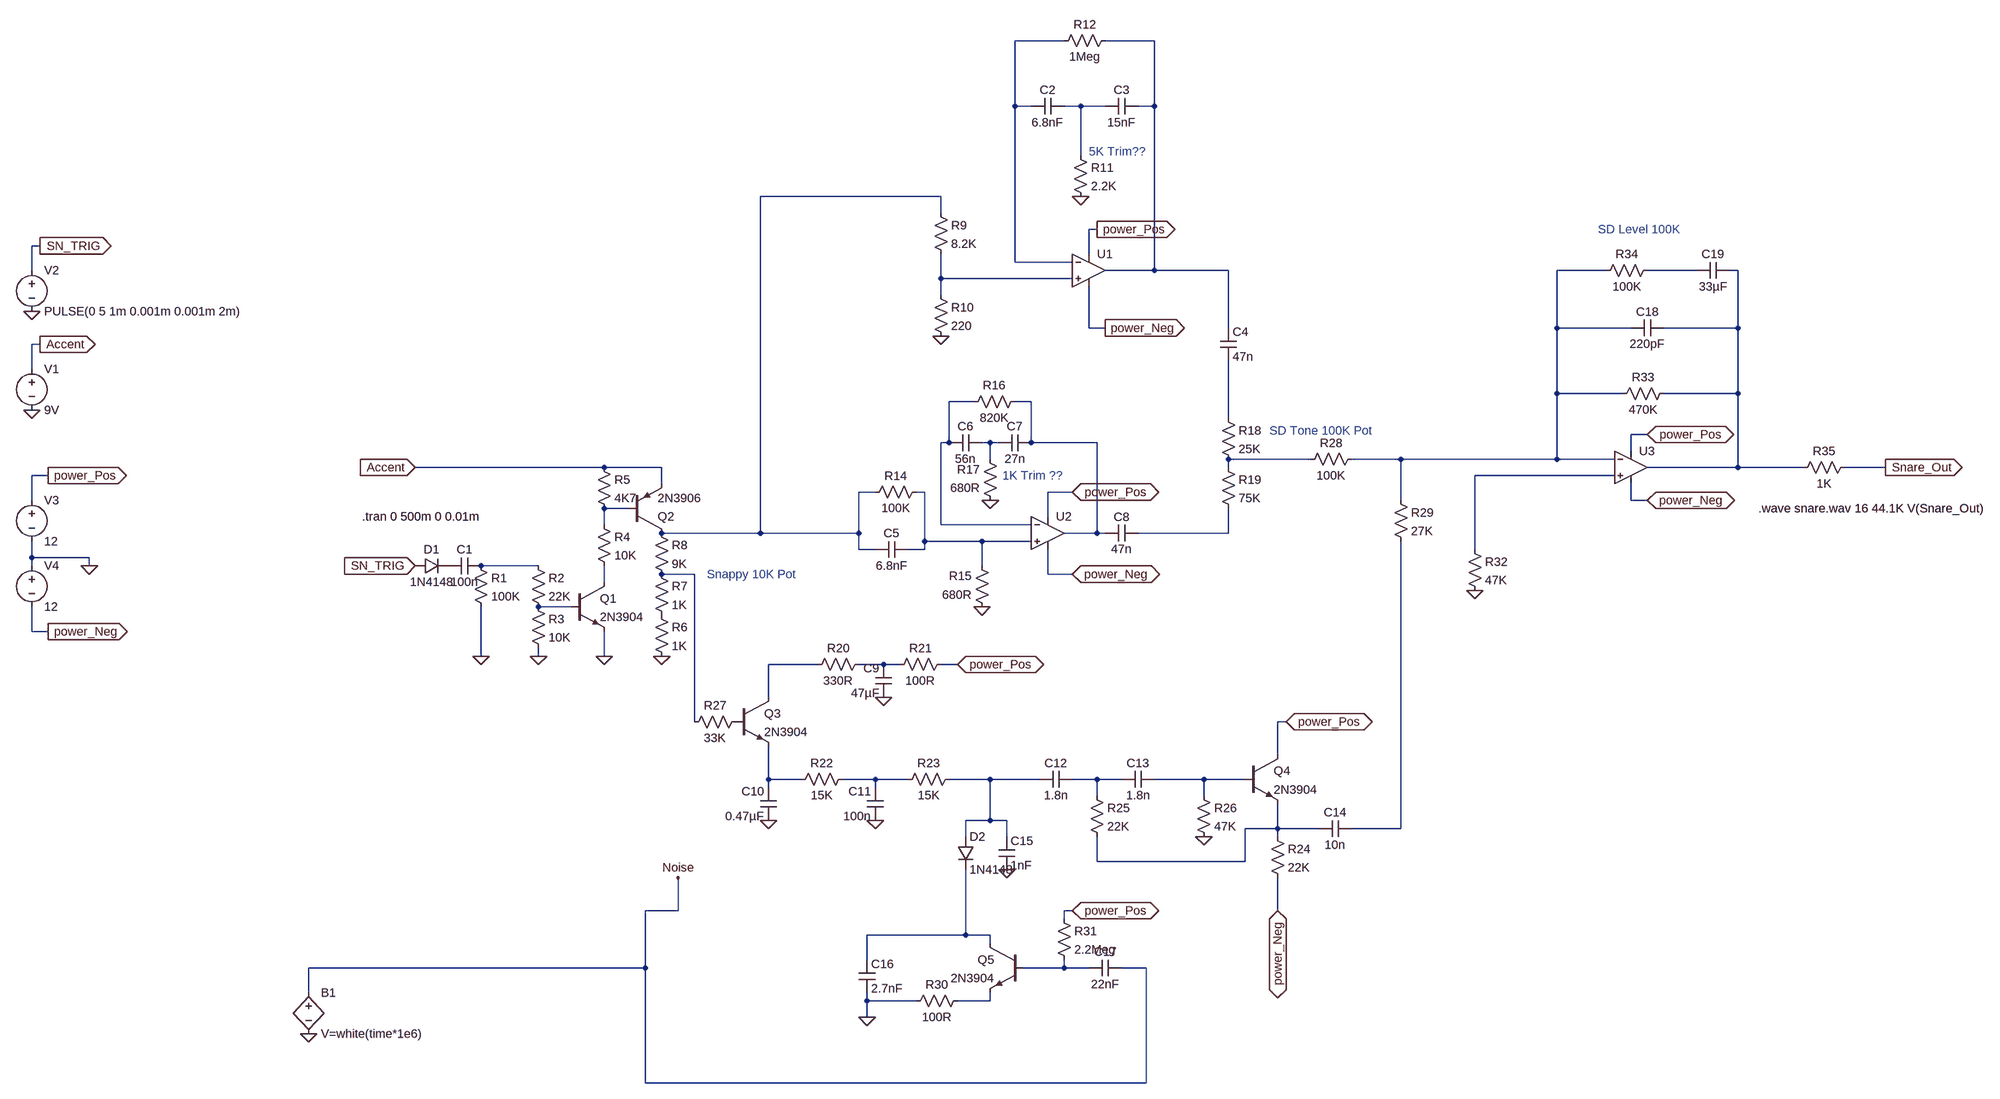
[diagram p0: schematic Snare.asc]
Snare.asc, the LTspice schematic file:
Version 4
SHEET 1 3088 1092
WIRE 1264 -944 1168 -944
WIRE 1440 -944 1344 -944
WIRE 1168 -816 1168 -944
WIRE 1200 -816 1168 -816
WIRE 1296 -816 1264 -816
WIRE 1344 -816 1296 -816
WIRE 1440 -816 1440 -944
WIRE 1440 -816 1408 -816
WIRE 1296 -720 1296 -816
WIRE 1024 -640 672 -640
WIRE 1024 -608 1024 -640
WIRE 1328 -576 1312 -576
WIRE -816 -544 -832 -544
WIRE 1312 -528 1312 -576
WIRE 1168 -512 1168 -816
WIRE 1280 -512 1168 -512
WIRE -832 -496 -832 -544
WIRE 1440 -496 1440 -816
WIRE 1440 -496 1344 -496
WIRE 1584 -496 1440 -496
WIRE 2320 -496 2224 -496
WIRE 2496 -496 2400 -496
WIRE 2576 -496 2560 -496
WIRE 1024 -480 1024 -528
WIRE 1280 -480 1024 -480
WIRE 1024 -448 1024 -480
WIRE 1312 -384 1312 -464
WIRE 1344 -384 1312 -384
WIRE 1584 -384 1584 -496
WIRE 2224 -384 2224 -496
WIRE 2368 -384 2224 -384
WIRE 2576 -384 2576 -496
WIRE 2576 -384 2432 -384
WIRE -816 -352 -832 -352
WIRE -832 -304 -832 -352
WIRE 2224 -256 2224 -384
WIRE 2352 -256 2224 -256
WIRE 2576 -256 2576 -384
WIRE 2576 -256 2432 -256
WIRE 1088 -240 1040 -240
WIRE 1200 -240 1168 -240
WIRE 1584 -208 1584 -320
WIRE 2400 -176 2368 -176
WIRE 1040 -160 1040 -240
WIRE 1040 -160 1024 -160
WIRE 1120 -160 1104 -160
WIRE 1136 -160 1120 -160
WIRE 1200 -160 1200 -240
WIRE 1328 -160 1200 -160
WIRE 2368 -144 2368 -176
WIRE 1120 -128 1120 -160
WIRE 1744 -128 1584 -128
WIRE 1920 -128 1824 -128
WIRE 2224 -128 2224 -256
WIRE 2224 -128 1920 -128
WIRE 2336 -128 2224 -128
WIRE 368 -112 0 -112
WIRE 480 -112 368 -112
WIRE 1584 -112 1584 -128
WIRE 2576 -112 2576 -256
WIRE 2576 -112 2400 -112
WIRE 2704 -112 2576 -112
WIRE 2864 -112 2784 -112
WIRE -800 -96 -832 -96
WIRE 2336 -96 2064 -96
WIRE 480 -80 480 -112
WIRE 896 -64 864 -64
WIRE 992 -64 976 -64
WIRE 1280 -64 1232 -64
WIRE -832 -48 -832 -96
WIRE 1920 -48 1920 -128
WIRE 2368 -48 2368 -80
WIRE 2400 -48 2368 -48
WIRE 416 -32 368 -32
WIRE 1232 -16 1232 -64
WIRE 368 0 368 -32
WIRE 1024 0 1024 -160
WIRE 1200 0 1024 0
WIRE 672 16 672 -640
WIRE 672 16 480 16
WIRE 864 16 864 -64
WIRE 864 16 672 16
WIRE 1328 16 1328 -160
WIRE 1328 16 1264 16
WIRE 1344 16 1328 16
WIRE 1584 16 1584 -32
WIRE 1584 16 1408 16
WIRE 992 32 992 -64
WIRE 1104 32 992 32
WIRE 1200 32 1104 32
WIRE 864 48 864 16
WIRE 896 48 864 48
WIRE 992 48 992 32
WIRE 992 48 960 48
WIRE 2064 48 2064 -96
WIRE -832 64 -832 32
WIRE -720 64 -832 64
WIRE -832 80 -832 64
WIRE -720 80 -720 64
WIRE 240 80 128 80
WIRE 1104 80 1104 32
WIRE 544 96 480 96
WIRE 1232 96 1232 48
WIRE 1280 96 1232 96
WIRE 368 112 368 80
WIRE 304 160 240 160
WIRE -832 208 -832 160
WIRE -800 208 -832 208
WIRE 128 256 128 160
WIRE 240 256 240 240
WIRE 368 256 368 208
WIRE 784 272 688 272
WIRE 912 272 864 272
WIRE 944 272 912 272
WIRE 1056 272 1024 272
WIRE 688 336 688 272
WIRE 544 384 544 96
WIRE 1696 384 1680 384
WIRE 1680 448 1680 384
WIRE 688 496 688 432
WIRE 752 496 688 496
WIRE 896 496 832 496
WIRE 960 496 896 496
WIRE 1120 496 1040 496
WIRE 1216 496 1120 496
WIRE 1328 496 1280 496
WIRE 1376 496 1328 496
WIRE 1536 496 1440 496
WIRE 1616 496 1536 496
WIRE 688 512 688 496
WIRE 896 512 896 496
WIRE 1328 528 1328 496
WIRE 1536 528 1536 496
WIRE 1120 576 1120 496
WIRE 1120 576 1072 576
WIRE 1152 576 1120 576
WIRE 1680 592 1680 544
WIRE 1680 592 1616 592
WIRE 1760 592 1680 592
WIRE 1920 592 1920 32
WIRE 1920 592 1824 592
WIRE 1072 608 1072 576
WIRE 1152 608 1152 576
WIRE 1680 608 1680 592
WIRE 1328 656 1328 608
WIRE 1616 656 1616 592
WIRE 1616 656 1328 656
WIRE 512 752 512 688
WIRE 512 752 448 752
WIRE 1280 752 1264 752
WIRE 1680 752 1680 688
WIRE 1264 768 1264 752
WIRE 1072 800 1072 672
WIRE 1072 800 880 800
WIRE 1120 800 1072 800
WIRE 1120 816 1120 800
WIRE 880 848 880 800
WIRE 448 864 448 752
WIRE 448 864 -208 864
WIRE 1264 864 1264 848
WIRE 1264 864 1184 864
WIRE 1312 864 1264 864
WIRE 1424 864 1376 864
WIRE -208 912 -208 864
WIRE 880 928 880 912
WIRE 976 928 880 928
WIRE 1120 928 1120 912
WIRE 1120 928 1056 928
WIRE 880 960 880 928
WIRE 448 1088 448 864
WIRE 1424 1088 1424 864
WIRE 1424 1088 448 1088
FLAG -816 -352 Accent
IOPIN -816 -352 Out
FLAG 0 80 SN_TRIG
IOPIN 0 80 In
FLAG 128 256 0
FLAG 240 256 0
FLAG 368 256 0
FLAG 480 256 0
FLAG -832 -224 0
FLAG -832 -416 0
FLAG 0 -112 Accent
IOPIN 0 -112 In
FLAG -816 -544 SN_TRIG
IOPIN -816 -544 Out
FLAG 1328 -576 power_Pos
IOPIN 1328 -576 Out
FLAG -800 208 power_Neg
IOPIN -800 208 Out
FLAG -720 80 0
FLAG 1296 -640 0
FLAG 1024 -368 0
FLAG -800 -96 power_Pos
IOPIN -800 -96 Out
FLAG 1344 -384 power_Neg
IOPIN 1344 -384 Out
FLAG 1120 -48 0
FLAG 1104 160 0
FLAG 1280 -64 power_Pos
IOPIN 1280 -64 BiDir
FLAG 1280 96 power_Neg
IOPIN 1280 96 BiDir
FLAG 1056 272 power_Pos
IOPIN 1056 272 BiDir
FLAG 1696 384 power_Pos
IOPIN 1696 384 BiDir
FLAG 1680 752 power_Neg
IOPIN 1680 752 BiDir
FLAG 1536 608 0
FLAG 688 576 0
FLAG 896 576 0
FLAG 912 336 0
FLAG 1152 672 0
FLAG 880 960 0
FLAG 1280 752 power_Pos
IOPIN 1280 752 BiDir
FLAG 512 688 Noise
FLAG -208 992 0
FLAG 2864 -112 Snare_Out
IOPIN 2864 -112 Out
FLAG 2064 128 0
FLAG 2400 -176 power_Pos
IOPIN 2400 -176 BiDir
FLAG 2400 -48 power_Neg
IOPIN 2400 -48 BiDir
SYMBOL diode 0 96 R270
WINDOW 0 32 32 VTop 2
WINDOW 3 0 32 VBottom 2
SYMATTR InstName D1
SYMATTR Value 1N4148
SYMBOL cap 128 64 R90
WINDOW 0 0 32 VBottom 2
WINDOW 3 32 32 VTop 2
SYMATTR InstName C1
SYMATTR Value 100n
SYMBOL res 112 64 R0
SYMATTR InstName R1
SYMATTR Value 100K
SYMBOL res 224 64 R0
SYMATTR InstName R2
SYMATTR Value 22K
SYMBOL res 224 144 R0
SYMATTR InstName R3
SYMATTR Value 10K
SYMBOL res 352 -16 R0
SYMATTR InstName R4
SYMATTR Value 10K
SYMBOL pnp 416 16 M180
SYMATTR InstName Q2
SYMATTR Value 2N3906
SYMBOL npn 304 112 R0
SYMATTR InstName Q1
SYMATTR Value 2N3904
SYMBOL res 352 -128 R0
SYMATTR InstName R5
SYMATTR Value 4K7
SYMBOL res 464 160 R0
SYMATTR InstName R6
SYMATTR Value 1K
SYMBOL res 464 80 R0
SYMATTR InstName R7
SYMATTR Value 1K
SYMBOL res 464 0 R0
SYMATTR InstName R8
SYMATTR Value 9K
SYMBOL voltage -832 -320 R0
WINDOW 123 0 0 Left 0
WINDOW 39 0 0 Left 0
SYMATTR InstName V1
SYMATTR Value 9V
SYMBOL voltage -832 -512 R0
WINDOW 123 0 0 Left 0
WINDOW 39 0 0 Left 0
SYMATTR InstName V2
SYMATTR Value PULSE(0 5 1m 0.001m 0.001m 2m)
SYMBOL voltage -832 -64 R0
WINDOW 123 0 0 Left 0
WINDOW 39 0 0 Left 0
SYMATTR InstName V3
SYMATTR Value 12
SYMBOL voltage -832 64 R0
WINDOW 123 0 0 Left 0
WINDOW 39 0 0 Left 0
SYMATTR InstName V4
SYMATTR Value 12
SYMBOL res 1008 -624 R0
SYMATTR InstName R9
SYMATTR Value 8.2K
SYMBOL res 1008 -464 R0
SYMATTR InstName R10
SYMATTR Value 220
SYMBOL res 1280 -736 R0
SYMATTR InstName R11
SYMATTR Value 2.2K
SYMBOL res 1360 -960 R90
WINDOW 0 0 56 VBottom 2
WINDOW 3 32 56 VTop 2
SYMATTR InstName R12
SYMATTR Value 1Meg
SYMBOL cap 1264 -832 R90
WINDOW 0 0 32 VBottom 2
WINDOW 3 32 32 VTop 2
SYMATTR InstName C2
SYMATTR Value 6.8nF
SYMBOL cap 1408 -832 R90
WINDOW 0 0 32 VBottom 2
WINDOW 3 32 32 VTop 2
SYMATTR InstName C3
SYMATTR Value 15nF
SYMBOL OpAmps\\UniversalOpamp2 1312 -496 R0
SYMATTR InstName U1
SYMBOL cap 1568 -384 R0
SYMATTR InstName C4
SYMATTR Value 47n
SYMBOL cap 960 32 R90
WINDOW 0 0 32 VBottom 2
WINDOW 3 32 32 VTop 2
SYMATTR InstName C5
SYMATTR Value 6.8nF
SYMBOL res 992 -80 R90
WINDOW 0 0 56 VBottom 2
WINDOW 3 32 56 VTop 2
SYMATTR InstName R14
SYMATTR Value 100K
SYMBOL res 1120 176 R180
WINDOW 0 36 76 Left 2
WINDOW 3 36 40 Left 2
SYMATTR InstName R15
SYMATTR Value 680R
SYMBOL cap 1104 -176 R90
WINDOW 0 0 32 VBottom 2
WINDOW 3 32 32 VTop 2
SYMATTR InstName C6
SYMATTR Value 56n
SYMBOL cap 1200 -176 R90
WINDOW 0 0 32 VBottom 2
WINDOW 3 32 32 VTop 2
SYMATTR InstName C7
SYMATTR Value 27n
SYMBOL res 1184 -256 R90
WINDOW 0 0 56 VBottom 2
WINDOW 3 32 56 VTop 2
SYMATTR InstName R16
SYMATTR Value 820K
SYMBOL res 1136 -32 R180
WINDOW 0 36 76 Left 2
WINDOW 3 36 40 Left 2
SYMATTR InstName R17
SYMATTR Value 680R
SYMBOL OpAmps\\UniversalOpamp2 1232 16 R0
SYMATTR InstName U2
SYMBOL cap 1408 0 R90
WINDOW 0 0 32 VBottom 2
WINDOW 3 32 32 VTop 2
SYMATTR InstName C8
SYMATTR Value 47n
SYMBOL res 1568 -224 R0
SYMATTR InstName R18
SYMATTR Value 25K
SYMBOL res 1568 -128 R0
SYMATTR InstName R19
SYMATTR Value 75K
SYMBOL npn 624 336 R0
SYMATTR InstName Q3
SYMATTR Value 2N3904
SYMBOL res 880 256 R90
WINDOW 0 0 56 VBottom 2
WINDOW 3 32 56 VTop 2
SYMATTR InstName R20
SYMATTR Value 330R
SYMBOL res 1040 256 R90
WINDOW 0 0 56 VBottom 2
WINDOW 3 32 56 VTop 2
SYMATTR InstName R21
SYMATTR Value 100R
SYMBOL cap 928 336 R180
WINDOW 0 24 56 Left 2
WINDOW 3 24 8 Left 2
SYMATTR InstName C9
SYMATTR Value 47µF
SYMBOL cap 704 576 R180
WINDOW 0 24 56 Left 2
WINDOW 3 24 8 Left 2
SYMATTR InstName C10
SYMATTR Value 0.47µF
SYMBOL cap 912 576 R180
WINDOW 0 24 56 Left 2
WINDOW 3 24 8 Left 2
SYMATTR InstName C11
SYMATTR Value 100n
SYMBOL res 848 480 R90
WINDOW 0 0 56 VBottom 2
WINDOW 3 32 56 VTop 2
SYMATTR InstName R22
SYMATTR Value 15K
SYMBOL res 1056 480 R90
WINDOW 0 0 56 VBottom 2
WINDOW 3 32 56 VTop 2
SYMATTR InstName R23
SYMATTR Value 15K
SYMBOL cap 1280 480 R90
WINDOW 0 0 32 VBottom 2
WINDOW 3 32 32 VTop 2
SYMATTR InstName C12
SYMATTR Value 1.8n
SYMBOL cap 1440 480 R90
WINDOW 0 0 32 VBottom 2
WINDOW 3 32 32 VTop 2
SYMATTR InstName C13
SYMATTR Value 1.8n
SYMBOL npn 1616 448 R0
SYMATTR InstName Q4
SYMATTR Value 2N3904
SYMBOL res 1664 592 R0
SYMATTR InstName R24
SYMATTR Value 22K
SYMBOL res 1312 512 R0
SYMATTR InstName R25
SYMATTR Value 22K
SYMBOL res 1520 512 R0
SYMATTR InstName R26
SYMATTR Value 47K
SYMBOL res 640 368 R90
WINDOW 0 0 56 VBottom 2
WINDOW 3 32 56 VTop 2
SYMATTR InstName R27
SYMATTR Value 33K
SYMBOL res 1840 -144 R90
WINDOW 0 0 56 VBottom 2
WINDOW 3 32 56 VTop 2
SYMATTR InstName R28
SYMATTR Value 100K
SYMBOL res 1904 -64 R0
SYMATTR InstName R29
SYMATTR Value 27K
SYMBOL cap 1824 576 R90
WINDOW 0 0 32 VBottom 2
WINDOW 3 32 32 VTop 2
SYMATTR InstName C14
SYMATTR Value 10n
SYMBOL diode 1056 608 R0
SYMATTR InstName D2
SYMATTR Value 1N4148
SYMBOL cap 1136 608 R0
SYMATTR InstName C15
SYMATTR Value 1nF
SYMBOL cap 864 848 R0
SYMATTR InstName C16
SYMATTR Value 2.7nF
SYMBOL res 1072 912 R90
WINDOW 0 0 56 VBottom 2
WINDOW 3 32 56 VTop 2
SYMATTR InstName R30
SYMATTR Value 100R
SYMBOL npn2 1184 816 M0
SYMATTR InstName Q5
SYMATTR Value 2N3904
SYMBOL res 1248 752 R0
SYMATTR InstName R31
SYMATTR Value 2.2Meg
SYMBOL cap 1376 848 R90
WINDOW 0 0 32 VBottom 2
WINDOW 3 32 32 VTop 2
SYMATTR InstName C17
SYMATTR Value 22nF
SYMBOL bv -208 896 R0
SYMATTR InstName B1
SYMATTR Value V=white(time*1e6)
SYMBOL res 2048 32 R0
SYMATTR InstName R32
SYMATTR Value 47K
SYMBOL res 2448 -272 R90
WINDOW 0 0 56 VBottom 2
WINDOW 3 32 56 VTop 2
SYMATTR InstName R33
SYMATTR Value 470K
SYMBOL cap 2432 -400 R90
WINDOW 0 0 32 VBottom 2
WINDOW 3 32 32 VTop 2
SYMATTR InstName C18
SYMATTR Value 220pF
SYMBOL cap 2560 -512 R90
WINDOW 0 0 32 VBottom 2
WINDOW 3 32 32 VTop 2
SYMATTR InstName C19
SYMATTR Value 33µF
SYMBOL res 2416 -512 R90
WINDOW 0 0 56 VBottom 2
WINDOW 3 32 56 VTop 2
SYMATTR InstName R34
SYMATTR Value 100K
SYMBOL res 2800 -128 R90
WINDOW 0 0 56 VBottom 2
WINDOW 3 32 56 VTop 2
SYMATTR InstName R35
SYMATTR Value 1K
SYMBOL OpAmps\\UniversalOpamp2 2368 -112 R0
SYMATTR InstName U3
TEXT -104 -16 Left 2 !.tran 0 500m 0 0.01m
TEXT 2304 -576 Left 2 ;SD Level 100K
TEXT 568 96 Left 2 ;Snappy 10K Pot
TEXT 1664 -184 Left 2 ;SD Tone 100K Pot
TEXT 2616 -32 Left 2 !.wave snare.wav 16 44.1K V(Snare_Out)
TEXT 1312 -728 Left 2 ;5K Trim??
TEXT 1144 -96 Left 2 ;1K Trim ??

The netlist it stands for:
* Snare.asc
D1 SN_TRIG P001 1N4148
C1 N018 P001 100n
R1 N018 0 100K
R2 N018 N021 22K
R3 N021 0 10K
R4 N016 N020 10K
Q2 N004 N016 Accent 0 2N3906
Q1 N020 N021 0 0 2N3904
R5 Accent N016 4K7
R6 P002 0 1K
R7 N019 P002 1K
R8 N004 N019 9K
V1 Accent 0 9V
V2 SN_TRIG 0 PULSE(0 5 1m 0.001m 0.001m 2m)
V3 power_Pos 0 12
V4 0 power_Neg 12
R9 N004 N008 8.2K
R10 N008 0 220
R11 N003 0 2.2K
R12 N002 N001 1Meg
C2 N003 N001 6.8nF
C3 N002 N003 15nF
XU1 N008 N001 power_Pos power_Neg N002 level.2 Avol=1Meg GBW=10Meg Slew=10Meg ilimit=25m rail=0 Vos=0 phimargin=45 en=0 enk=0 in=0 ink=0 Rin=500Meg  ; pins IN+ IN- V+ V- OUT
C4 N002 N011 47n
C5 N015 N004 6.8nF
R14 N015 N004 100K
R15 0 N015 680R
C6 N012 N009 56n
C7 N010 N012 27n
R16 N010 N009 820K
R17 0 N012 680R
XU2 N015 N009 power_Pos power_Neg N010 level.2 Avol=1Meg GBW=10Meg Slew=10Meg ilimit=25m rail=0 Vos=0 phimargin=45 en=0 enk=0 in=0 ink=0 Rin=500Meg  ; pins IN+ IN- V+ V- OUT
C8 N017 N010 47n
R18 N011 N013 25K
R19 N013 N017 75K
Q3 N022 P003 N024 0 2N3904
R20 N023 N022 330R
R21 power_Pos N023 100R
C9 0 N023 47µF
C10 0 N024 0.47µF
C11 0 N025 100n
R22 N025 N024 15K
R23 N026 N025 15K
C12 N027 N026 1.8n
C13 N028 N027 1.8n
Q4 power_Pos N028 N029 0 2N3904
R24 N029 power_Neg 22K
R25 N027 N029 22K
R26 N028 0 47K
R27 P003 N019 33K
R28 N005 N013 100K
R29 N005 N030 27K
C14 N030 N029 10n
D2 N026 N031 1N4148
C15 N026 0 1nF
C16 N031 0 2.7nF
R30 N033 0 100R
Q5 N031 N032 N033 0 2N3904
R31 power_Pos N032 2.2Meg
C17 Noise N032 22nF
B1 Noise 0 V=white(time*1e6)
R32 N014 0 47K
R33 N007 N005 470K
C18 N007 N005 220pF
C19 N007 N006 33µF
R34 N006 N005 100K
R35 Snare_Out N007 1K
XU3 N014 N005 power_Pos power_Neg N007 level.2 Avol=1Meg GBW=10Meg Slew=10Meg ilimit=25m rail=0 Vos=0 phimargin=45 en=0 enk=0 in=0 ink=0 Rin=500Meg  ; pins IN+ IN- V+ V- OUT
.model D D
.lib standard.dio
.model NPN NPN
.model PNP PNP
.lib standard.bjt
.tran 0 500m 0 0.01m
* SD Level 100K
* Snappy 10K Pot
* SD Tone 100K Pot
.wave snare.wav 16 44.1K V(Snare_Out)
* 5K Trim??
* 1K Trim ??
.lib UniversalOpamps2.sub
.backanno
.end